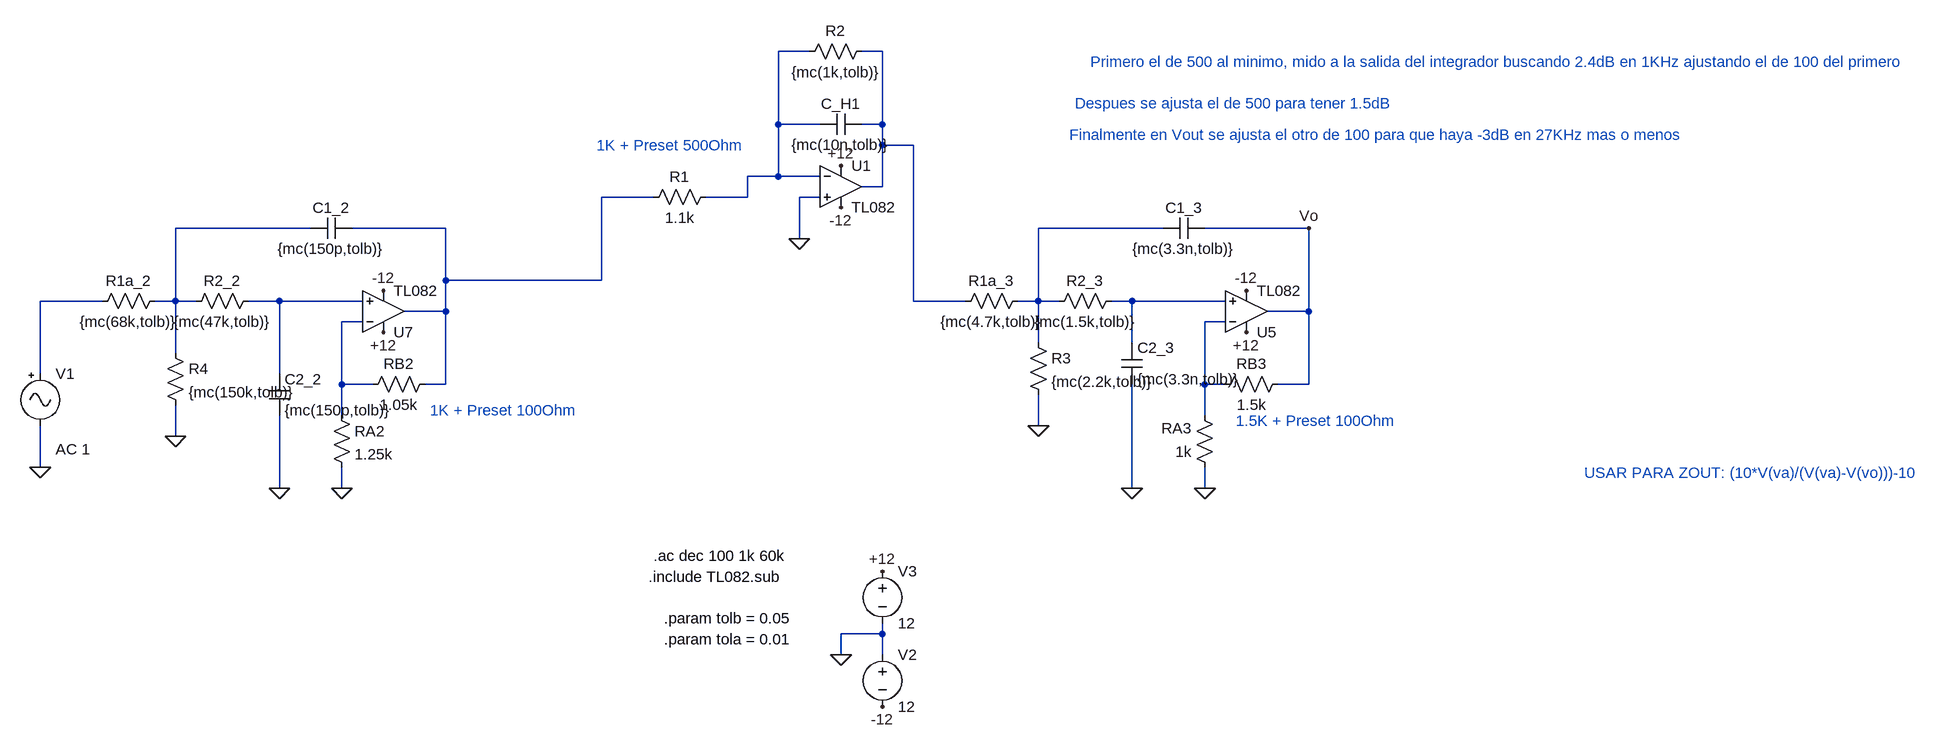
[diagram p0: schematic FiltroLP.asc]
FiltroLP.asc, the LTspice schematic file:
Version 4
SHEET 1 2408 784
WIRE 416 -304 368 -304
WIRE 528 -304 496 -304
WIRE 368 -192 368 -304
WIRE 432 -192 368 -192
WIRE 528 -192 528 -304
WIRE 528 -192 496 -192
WIRE 528 -160 528 -192
WIRE 576 -160 528 -160
WIRE 368 -112 368 -192
WIRE 368 -112 320 -112
WIRE 432 -112 368 -112
WIRE 528 -96 528 -160
WIRE 528 -96 496 -96
WIRE 176 -80 96 -80
WIRE 320 -80 320 -112
WIRE 320 -80 256 -80
WIRE 432 -80 400 -80
WIRE -352 -32 -560 -32
WIRE -144 -32 -288 -32
WIRE 960 -32 768 -32
WIRE 1184 -32 1024 -32
WIRE 400 -16 400 -80
WIRE -144 48 -144 -32
WIRE 96 48 96 -80
WIRE 96 48 -144 48
WIRE -672 80 -768 80
WIRE -560 80 -560 -32
WIRE -560 80 -592 80
WIRE -528 80 -560 80
WIRE -400 80 -448 80
WIRE -272 80 -400 80
WIRE 576 80 576 -160
WIRE 656 80 576 80
WIRE 768 80 768 -32
WIRE 768 80 736 80
WIRE 800 80 768 80
WIRE 912 80 880 80
WIRE 1056 80 912 80
WIRE -144 96 -144 48
WIRE -144 96 -208 96
WIRE 1184 96 1184 -32
WIRE 1184 96 1120 96
WIRE -272 112 -304 112
WIRE 1056 112 1024 112
WIRE 768 144 768 80
WIRE 912 144 912 80
WIRE -560 160 -560 80
WIRE -768 192 -768 80
WIRE -400 192 -400 80
WIRE -304 208 -304 112
WIRE -256 208 -304 208
WIRE -144 208 -144 96
WIRE -144 208 -176 208
WIRE 1024 208 1024 112
WIRE 1056 208 1024 208
WIRE 1184 208 1184 96
WIRE 1184 208 1136 208
WIRE -304 256 -304 208
WIRE 1024 256 1024 208
WIRE 768 272 768 224
WIRE -560 288 -560 240
WIRE -768 336 -768 272
WIRE -400 368 -400 256
WIRE -304 368 -304 336
WIRE 912 368 912 208
WIRE 1024 368 1024 336
WIRE 528 592 528 576
WIRE 528 592 464 592
WIRE 464 624 464 592
WIRE 528 624 528 592
FLAG -304 368 0
FLAG -400 368 0
FLAG -768 336 0
FLAG 1024 368 0
FLAG 912 368 0
FLAG 768 272 0
FLAG -560 288 0
FLAG 400 -16 0
FLAG 464 624 0
FLAG 528 496 +12
FLAG -240 128 +12
FLAG 1088 128 +12
FLAG 528 704 -12
FLAG -240 64 -12
FLAG 1088 64 -12
FLAG 464 -128 +12
FLAG 464 -64 -12
FLAG 1184 -32 Vo
SYMBOL res -160 192 R90
WINDOW 0 0 56 VBottom 2
WINDOW 3 32 56 VTop 2
SYMATTR InstName RB2
SYMATTR Value 1.05k
SYMBOL res -320 240 R0
SYMATTR InstName RA2
SYMATTR Value 1.25k
SYMBOL res -432 64 R90
WINDOW 0 0 56 VBottom 2
WINDOW 3 32 56 VTop 2
SYMATTR InstName R2_2
SYMATTR Value {mc(47k,tolb)}
SYMBOL res -576 64 R90
WINDOW 0 0 56 VBottom 2
WINDOW 3 32 56 VTop 2
SYMATTR InstName R1a_2
SYMATTR Value {mc(68k,tolb)}
SYMBOL cap -416 192 R0
SYMATTR InstName C2_2
SYMATTR Value {mc(150p,tolb)}
SYMBOL cap -288 -48 R90
WINDOW 0 0 32 VBottom 2
WINDOW 3 32 32 VTop 2
SYMATTR InstName C1_2
SYMATTR Value {mc(150p,tolb)}
SYMBOL Misc\\signal -768 176 R0
WINDOW 123 24 132 Left 2
WINDOW 39 0 0 Left 2
SYMATTR Value2 AC 1
SYMATTR InstName V1
SYMATTR Value ""
SYMBOL res 752 64 R90
WINDOW 0 0 56 VBottom 2
WINDOW 3 32 56 VTop 2
SYMATTR InstName R1a_3
SYMATTR Value {mc(4.7k,tolb)}
SYMBOL res 896 64 R90
WINDOW 0 0 56 VBottom 2
WINDOW 3 32 56 VTop 2
SYMATTR InstName R2_3
SYMATTR Value {mc(1.5k,tolb)}
SYMBOL cap 896 144 R0
SYMATTR InstName C2_3
SYMATTR Value {mc(3.3n,tolb)}
SYMBOL res 1152 192 R90
WINDOW 0 0 56 VBottom 2
WINDOW 3 32 56 VTop 2
SYMATTR InstName RB3
SYMATTR Value 1.5k
SYMBOL res 1040 352 R180
WINDOW 0 36 76 Left 2
WINDOW 3 36 40 Left 2
SYMATTR InstName RA3
SYMATTR Value 1k
SYMBOL cap 1024 -48 R90
WINDOW 0 0 32 VBottom 2
WINDOW 3 32 32 VTop 2
SYMATTR InstName C1_3
SYMATTR Value {mc(3.3n,tolb)}
SYMBOL res 272 -96 R90
WINDOW 0 0 56 VBottom 2
WINDOW 3 32 56 VTop 2
SYMATTR InstName R1
SYMATTR Value 1.1k
SYMBOL cap 432 -176 R270
WINDOW 0 32 32 VTop 2
WINDOW 3 0 32 VBottom 2
SYMATTR InstName C_H1
SYMATTR Value {mc(10n,tolb)}
SYMBOL res 512 -320 R90
WINDOW 0 0 56 VBottom 2
WINDOW 3 32 56 VTop 2
SYMATTR InstName R2
SYMATTR Value {mc(1k,tolb)}
SYMBOL res 752 128 R0
SYMATTR InstName R3
SYMATTR Value {mc(2.2k,tolb)}
SYMBOL res -576 144 R0
SYMATTR InstName R4
SYMATTR Value {mc(150k,tolb)}
SYMBOL Opamps\\opamp2 1088 160 M180
SYMATTR InstName U5
SYMATTR Value TL082
SYMBOL Opamps\\opamp2 -240 160 M180
SYMATTR InstName U7
SYMATTR Value TL082
SYMBOL voltage 528 608 R0
WINDOW 123 0 0 Left 2
WINDOW 39 0 0 Left 2
SYMATTR InstName V2
SYMATTR Value 12
SYMBOL voltage 528 480 R0
WINDOW 123 0 0 Left 2
WINDOW 39 0 0 Left 2
SYMATTR InstName V3
SYMATTR Value 12
SYMBOL Opamps\\opamp2 464 -160 R0
SYMATTR InstName U1
SYMATTR Value TL082
TEXT 176 472 Left 2 !.ac dec 100 1k 60k
TEXT 168 504 Left 2 !.include TL082.sub
TEXT 192 568 Left 2 !.param tolb = 0.05
TEXT 192 600 Left 2 !.param tola = 0.01
TEXT 1072 264 Left 2 ;1.5K + Preset 100Ohm
TEXT 88 -160 Left 2 ;1K + Preset 500Ohm
TEXT -168 248 Left 2 ;1K + Preset 100Ohm
TEXT 848 -288 Left 2 ;Primero el de 500 al minimo, mido a la salida del integrador buscando 2.4dB en 1KHz ajustando el de 100 del primero
TEXT 824 -224 Left 2 ;Despues se ajusta el de 500 para tener 1.5dB
TEXT 816 -176 Left 2 ;Finalmente en Vout se ajusta el otro de 100 para que haya -3dB en 27KHz mas o menos
TEXT 1608 344 Left 2 ;USAR PARA ZOUT: (10*V(va)/(V(va)-V(vo)))-10

The netlist it stands for:
* FiltroLP.asc
RB2 N003 N009 1.05k
RA2 N009 0 1.25k
R2_2 N007 N004 {mc(47k,tolb)}
R1a_2 N004 N006 {mc(68k,tolb)}
C2_2 N007 0 {mc(150p,tolb)}
C1_2 N003 N004 {mc(150p,tolb)}
V1 N006 0 AC 1
R1a_3 N005 N002 {mc(4.7k,tolb)}
R2_3 N008 N005 {mc(1.5k,tolb)}
C2_3 N008 0 {mc(3.3n,tolb)}
RB3 Vo N010 1.5k
RA3 0 N010 1k
C1_3 Vo N005 {mc(3.3n,tolb)}
R1 N001 N003 1.1k
C_H1 N001 N002 {mc(10n,tolb)}
R2 N002 N001 {mc(1k,tolb)}
R3 N005 0 {mc(2.2k,tolb)}
R4 N004 0 {mc(150k,tolb)}
XU5 N008 N010 +12 -12 Vo TL082  ; pins In+ In- V+ V- OUT
XU7 N007 N009 +12 -12 N003 TL082  ; pins In+ In- V+ V- OUT
V2 0 -12 12
V3 +12 0 12
XU1 0 N001 +12 -12 N002 TL082  ; pins In+ In- V+ V- OUT
.ac dec 100 1k 60k
.include TL082.sub
.param tolb = 0.05
.param tola = 0.01
* 1.5K + Preset 100Ohm
* 1K + Preset 500Ohm
* 1K + Preset 100Ohm
* Primero el de 500 al minimo, mido a la salida del integrador buscando 2.4dB en 1KHz ajustando el de 100 del primero
* Despues se ajusta el de 500 para tener 1.5dB
* Finalmente en Vout se ajusta el otro de 100 para que haya -3dB en 27KHz mas o menos
* USAR PARA ZOUT: (10*V(va)/(V(va)-V(vo)))-10
.backanno
.end